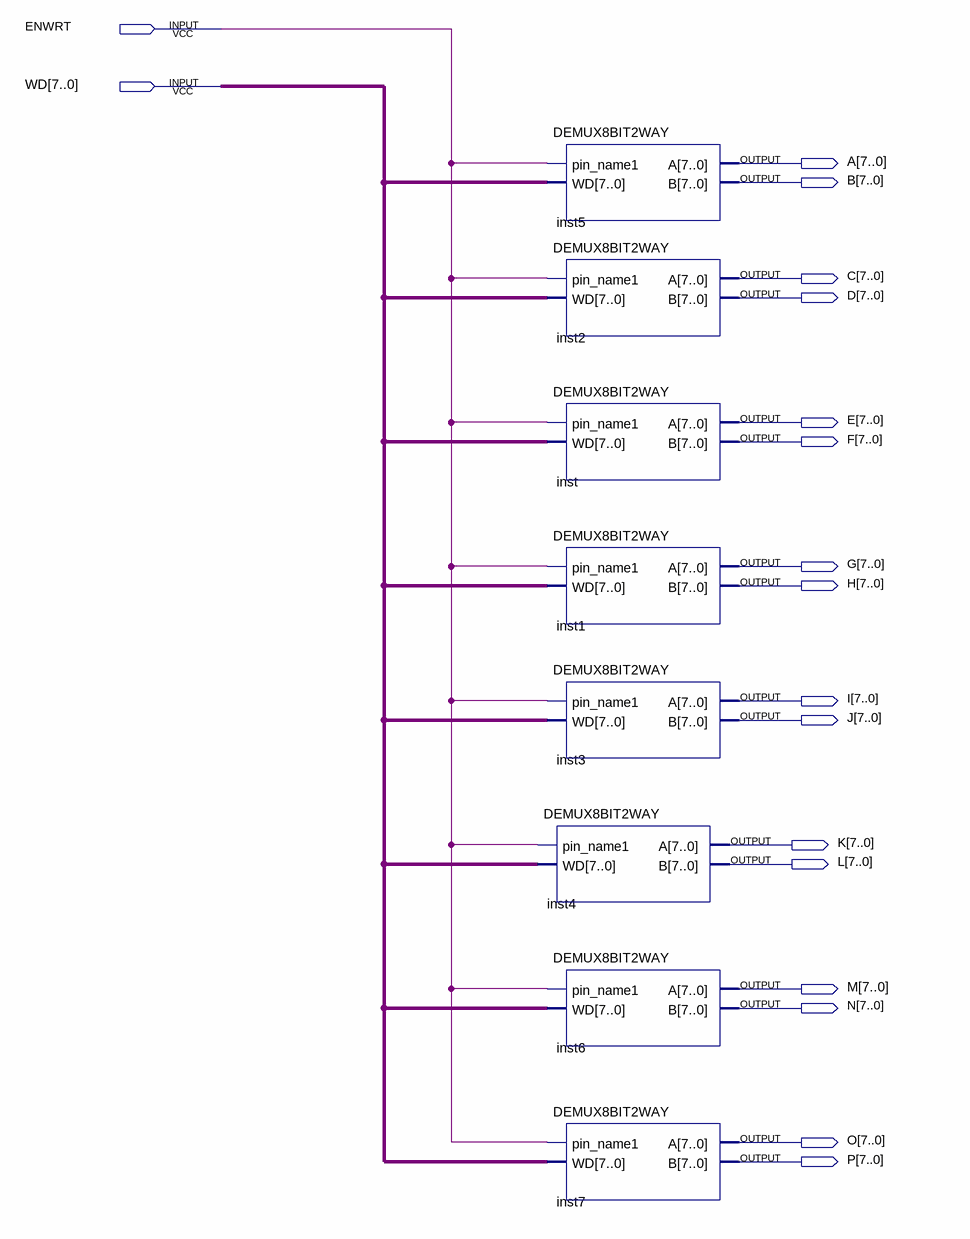
[diagram p0: schematic sheet]
// Quartus schematic DEMUX8bit16way.bdf as structural Verilog: 8 symbols, 18 pins
module DEMUX8bit16way (
  input  ENWRT,
  input  [7:0] WD,
  output [7:0] A,
  output [7:0] B,
  output [7:0] C,
  output [7:0] D,
  output [7:0] E,
  output [7:0] F,
  output [7:0] G,
  output [7:0] H,
  output [7:0] I,
  output [7:0] J,
  output [7:0] K,
  output [7:0] L,
  output [7:0] M,
  output [7:0] N,
  output [7:0] O,
  output [7:0] P
);

  DEMUX8BIT2WAY inst4 (.pin_name1(ENWRT), .WD(WD), .A(K), .B(L));
  DEMUX8BIT2WAY inst5 (.pin_name1(ENWRT), .WD(WD), .A(A), .B(B));
  DEMUX8BIT2WAY inst2 (.pin_name1(ENWRT), .WD(WD), .A(C), .B(D));
  DEMUX8BIT2WAY inst (.pin_name1(ENWRT), .WD(WD), .A(E), .B(F));
  DEMUX8BIT2WAY inst1 (.pin_name1(ENWRT), .WD(WD), .A(G), .B(H));
  DEMUX8BIT2WAY inst3 (.pin_name1(ENWRT), .WD(WD), .A(I), .B(J));
  DEMUX8BIT2WAY inst6 (.pin_name1(ENWRT), .WD(WD), .A(M), .B(N));
  DEMUX8BIT2WAY inst7 (.pin_name1(ENWRT), .WD(WD), .A(O), .B(P));
endmodule
